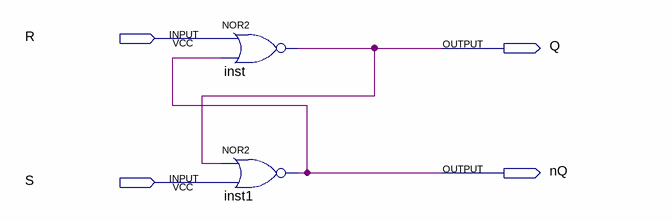
[diagram p0: schematic sheet]
// Quartus schematic srlatch.bdf as structural Verilog: 2 symbols, 4 pins
module srlatch (
  input  R,
  input  S,
  output Q,
  output nQ
);

  nor inst (Q, R, nQ);
  nor inst1 (nQ, Q, S);
endmodule
